# EAGLE design Mic to Pi Entire design including pinouts (EAGLE 9.6.2)
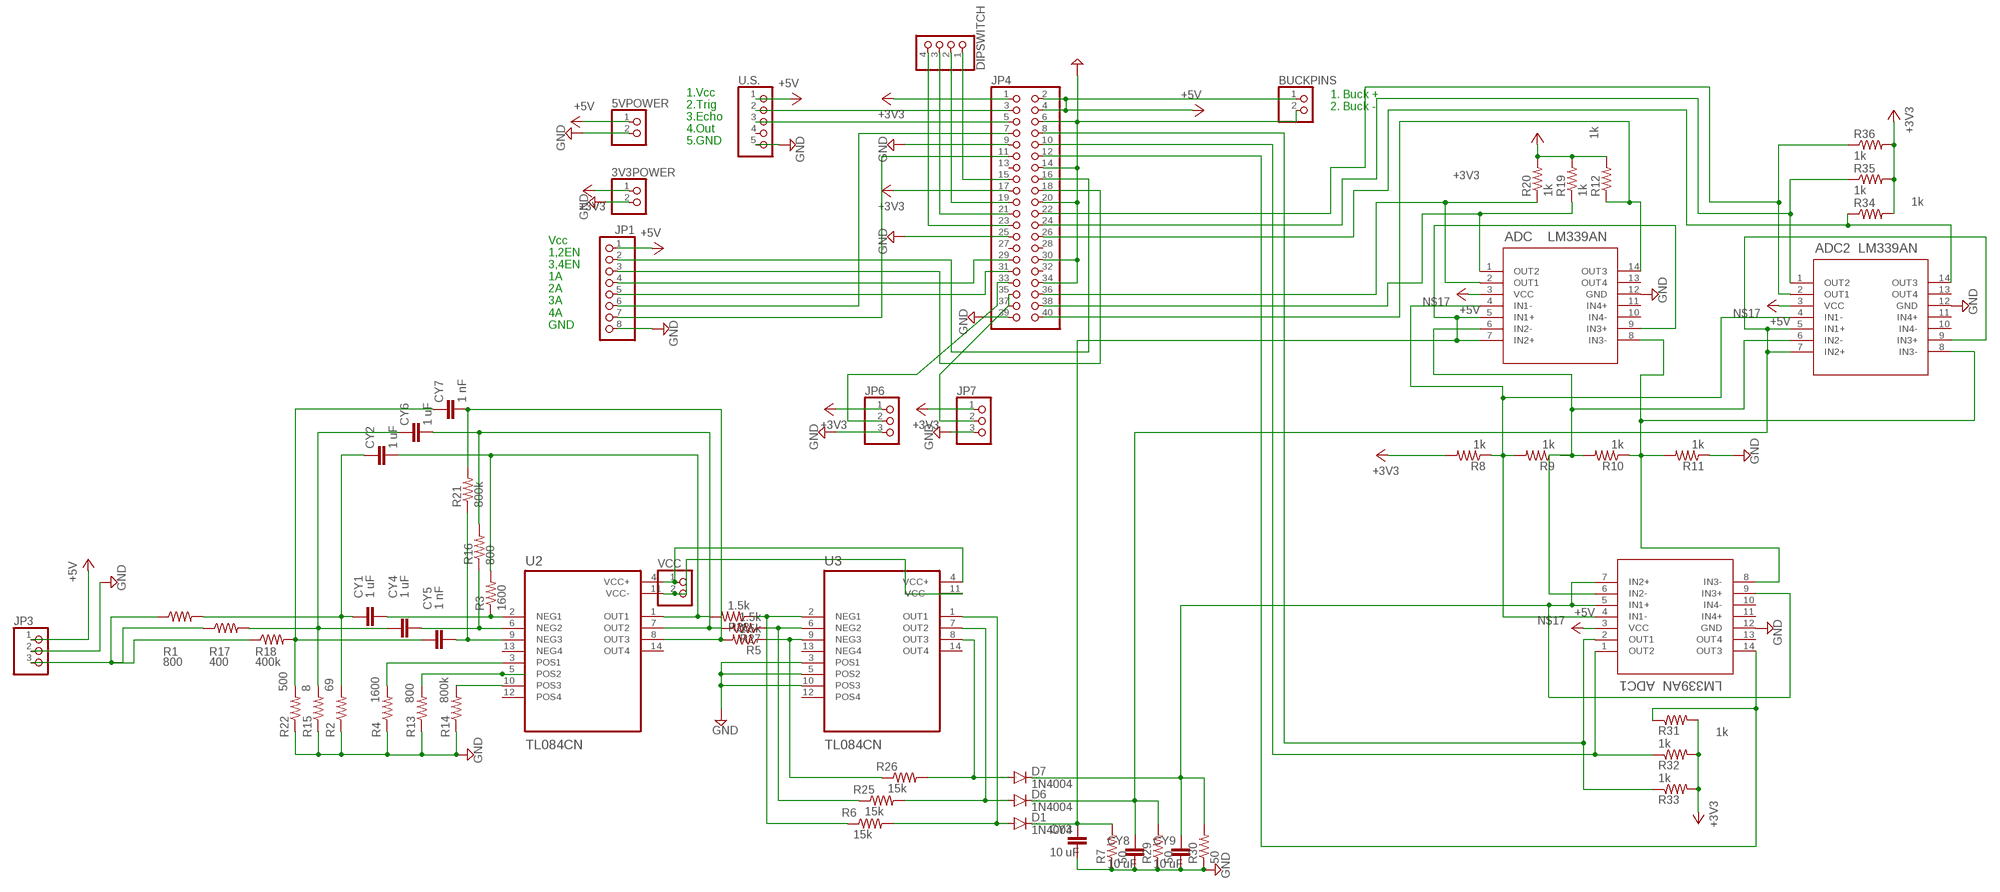
[diagram p0: schematic, sheet 1]

## Parts
3V3POWER  PINHD-1X2  [1X02]
5VPOWER  PINHD-1X2  [1X02]
ADC  LM339AN  [PDIP14_646-06_ONS]
ADC1  LM339AN  [PDIP14_646-06_ONS]
ADC2  LM339AN  [PDIP14_646-06_ONS]
BUCKPINS  PINHD-1X2  [1X02]
CY1  1 uF  CYYC7B5  [YC7B5]
CY2  1 uF  CYYC7B5  [YC7B5]
CY3  10 uF  CYYC7B5  [YC7B5]
CY4  1 uF  CYYC7B5  [YC7B5]
CY5  1 nF  CYYC7B5  [YC7B5]
CY6  1 uF  CYYC7B5  [YC7B5]
CY7  1 nF  CYYC7B5  [YC7B5]
CY8  10 uF  CYYC7B5  [YC7B5]
CY9  10 uF  CYYC7B5  [YC7B5]
D1  1N4004  [DO41-10]
D6  1N4004  [DO41-10]
D7  1N4004  [DO41-10]
DIPSWITCH  PINHD-1X4  [1X04]
JP1  PINHD-1X8  [1X08]
JP3  PINHD-1X3  [1X03]
JP4  PINHD-2X20  [2X20]
JP6  PINHD-1X3  [1X03]
JP7  PINHD-1X3  [1X03]
R1  800  R-US_0204/7  [0204/7]
R2  69  R-US_0204/7  [0204/7]
R3  1600  R-US_0204/7  [0204/7]
R4  1600  R-US_0204/7  [0204/7]
R5  1.5k  R-US_0204/7  [0204/7]
R6  15k  R-US_0204/7  [0204/7]
R7  50  R-US_0204/7  [0204/7]
R8  1k  R-US_0204/7  [0204/7]
R9  1k  R-US_0207/2V  [0207/2V]
R10  1k  R-US_0207/2V  [0207/2V]
R11  1k  R-US_0207/2V  [0207/2V]
R12  1k  R-US_0207/2V  [0207/2V]
R13  800  R-US_0204/7  [0204/7]
R14  800k  R-US_0204/7  [0204/7]
R15  8  R-US_0204/7  [0204/7]
R16  800  R-US_0204/7  [0204/7]
R17  400  R-US_0204/7  [0204/7]
R18  400k  R-US_0204/7  [0204/7]
R19  1k  R-US_0204/7  [0204/7]
R20  1k  R-US_0204/7  [0204/7]
R21  800k  R-US_0204/7  [0204/7]
R22  500  R-US_0204/7  [0204/7]
R25  15k  R-US_0204/7  [0204/7]
R26  15k  R-US_0204/7  [0204/7]
R27  1.5k  R-US_0204/7  [0204/7]
R28  1.5k  R-US_0204/7  [0204/7]
R29  50  R-US_0204/7  [0204/7]
R30  50  R-US_0204/7  [0204/7]
R31  1k  R-US_0207/2V  [0207/2V]
R32  1k  R-US_0204/7  [0204/7]
R33  1k  R-US_0204/7  [0204/7]
R34  1k  R-US_0207/2V  [0207/2V]
R35  1k  R-US_0204/7  [0204/7]
R36  1k  R-US_0204/7  [0204/7]
U2  TL084CN  [DIP794W45P254L1969H508Q14]
U3  TL084CN  [DIP794W45P254L1969H508Q14]
U.S.  PINHD-1X55X2MM  [1_05X2MM]
VCC  PINHD-1X2  [1X02]

## Nets
+3V3: 3V3POWER.1 JP4.1 JP4.17 JP6.1 JP7.1 R8.2 R12.2 R19.2 R20.2 R31.2 R32.2 R33.2 R34.2 R35.2 R36.2
+5V: 5VPOWER.1 ADC1.3(VCC) ADC2.3(VCC) ADC.3(VCC) BUCKPINS.1 JP1.1 JP3.1 JP4.2 JP4.4 U.S..1
GND: 3V3POWER.2 5VPOWER.2 ADC1.12(GND) ADC2.12(GND) ADC.12(GND) BUCKPINS.2 CY3.2 CY8.2 CY9.2 JP1.8 JP3.2 JP4.6 JP4.9 JP4.14 JP4.20 JP4.25 JP4.30 JP4.34 JP4.39 JP6.3 JP7.3 R2.1 R4.1 R7.1 R11.1 R13.1 R14.1 R15.1 R22.1 R29.1 R30.1 U3.3(POS1) U3.5(POS2) U3.10(POS3) U.S..5
N$1: R6.1 R28.1 U3.2(NEG1)
N$2: R13.2 U2.5(POS2)
N$3: R14.2 U2.10(POS3)
N$4: JP3.3 R1.1 R17.1 R18.1
N$5: CY4.1 CY6.1 R15.2 R17.2
N$6: CY5.1 CY7.1 R18.2 R22.2
N$7: CY4.2 R16.1 U2.6(NEG2)
N$8: CY2.2 R3.2 R28.2 U2.1(OUT1)
N$9: CY5.2 R21.1 U2.9(NEG3)
N$10: CY6.2 R16.2 R27.2 U2.7(OUT2)
N$11: CY1.1 CY2.1 R1.2 R2.2
N$12: CY1.2 R3.1 U2.2(NEG1)
N$13: R4.2 U2.3(POS1)
N$14: CY7.2 R5.2 R21.2 U2.8(OUT3)
N$15: ADC.5(IN1+) ADC.7(IN2+) ADC.9(IN3+) CY3.1 D1.C R7.2
N$16: ADC.1(OUT2) JP4.38 R19.1
N$17: ADC1.4(IN1-) ADC2.4(IN1-) ADC.4(IN1-) R8.1 R9.2
N$18: ADC1.6(IN2-) ADC2.6(IN2-) ADC.6(IN2-) R9.1 R10.2
N$19: ADC1.8(IN3-) ADC2.8(IN3-) ADC.8(IN3-) R10.1 R11.2
N$20: ADC.2(OUT1) JP4.36 R20.1
N$21: ADC.14(OUT3) JP4.40 R12.1
N$22: JP4.3 U.S..2
N$23: JP4.5 U.S..3
N$24: R25.1 R27.1 U3.6(NEG2)
N$25: D1.A R6.2 U3.1(OUT1)
N$26: R5.1 R26.1 U3.9(NEG3)
N$27: D7.A R26.2 U3.8(OUT3)
N$28: JP1.4 JP4.29
N$29: JP1.5 JP4.31
N$30: JP1.6 JP4.7
N$31: JP1.7 JP4.11
N$32: JP1.2 JP4.16
N$33: JP1.3 JP4.18
N$34: DIPSWITCH.1 JP4.15
N$35: DIPSWITCH.2 JP4.19
N$36: DIPSWITCH.3 JP4.21
N$37: DIPSWITCH.4 JP4.23
N$38: JP4.33 JP6.2
N$39: JP4.35 JP4.37 JP7.2
N$43: U2.11(VCC-) U3.11(VCC-) VCC.2
N$44: U2.4(VCC+) U3.4(VCC+) VCC.1
N$45: D6.A R25.2 U3.7(OUT2)
N$50: ADC2.5(IN1+) ADC2.7(IN2+) ADC2.9(IN3+) CY8.1 D6.C R29.2
N$51: ADC1.5(IN1+) ADC1.7(IN2+) ADC1.9(IN3+) CY9.1 D7.C R30.2
N$55: ADC1.1(OUT2) JP4.10 R32.1
N$56: ADC1.14(OUT3) JP4.12 R31.1
N$57: ADC1.2(OUT1) JP4.8 R33.1
N$61: ADC2.1(OUT2) JP4.24 R35.1
N$62: ADC2.14(OUT3) JP4.26 R34.1
N$63: ADC2.2(OUT1) JP4.22 R36.1
Unconnected: ADC1.10(IN4-) ADC1.11(IN4+) ADC1.13(OUT4) ADC2.10(IN4-) ADC2.11(IN4+) ADC2.13(OUT4) ADC.10(IN4-) ADC.11(IN4+) ADC.13(OUT4) JP4.13 JP4.27 JP4.28 JP4.32 U2.12(POS4) U2.13(NEG4) U2.14(OUT4) U3.12(POS4) U3.13(NEG4) U3.14(OUT4) U.S..4

## Notes on the sheet
- 1. Buck +
  2. Buck -
- 1.Vcc
  2.Trig
  3.Echo
  4.Out
  5.GND
- Vcc
  1,2EN
  3,4EN
  1A
  2A
  3A
  4A
  GND

## Library data of the parts
3V3POWER 5VPOWER BUCKPINS VCC = pinhead:PINHD-1X2: PIN HEADER
ADC ADC1 ADC2 = LM339AN:LM339AN; COPYRIGHT: Copyright (C) 2022 Ultra Librarian. All rights reserved.; DIGI-KEY_PART_NUMBER_1: 2156-LM339AN-HC-ND; DIGI-KEY_PART_NUMBER_2: 2156-LM339AN-ON-ND; DIGI-KEY_PART_NUMBER_3: 296-6605-5-ND; DIGI-KEY_PART_NUMBER_4: 497-1587-5-ND; DIGI-KEY_PART_NUMBER_5: LM339ANFS-ND; MANUFACTURER_PART_NUMBER: LM339AN; MFR_NAME: onsemi
CY1-CY9 = rcl:CY: Y CAPACITOR for power line; SPICEPREFIX: C
D1 D6 D7 = diode:1N4004: DIODE general purpose rectifier, 1 A
DIPSWITCH = pinhead:PINHD-1X4: PIN HEADER
JP1 = pinhead:PINHD-1X8: PIN HEADER
JP3 JP6 JP7 = pinhead:PINHD-1X3: PIN HEADER
JP4 = pinhead:PINHD-2X20: PIN HEADER
R1-R22 R25-R36 = rcl:R-US_: RESISTOR, American symbol; SPICEPREFIX: R
U2 U3 = TL084CN:TL084CN; DESCRIPTION: Quad High Slew Rate JFET-Input Operational Amplifier 14-PDIP 0 to 70; DIGI-KEY_PART_NUMBER: 296-1784-5-ND; MF: Texas Instruments; MP: TL084CN; PACKAGE: PDIP-14 Texas Instruments; PURCHASE-URL: https://pricing.snapeda.com/search/part/TL084CN/?ref=eda
U.S. = pinhead:PINHD-1X5: PIN HEADER

## Board
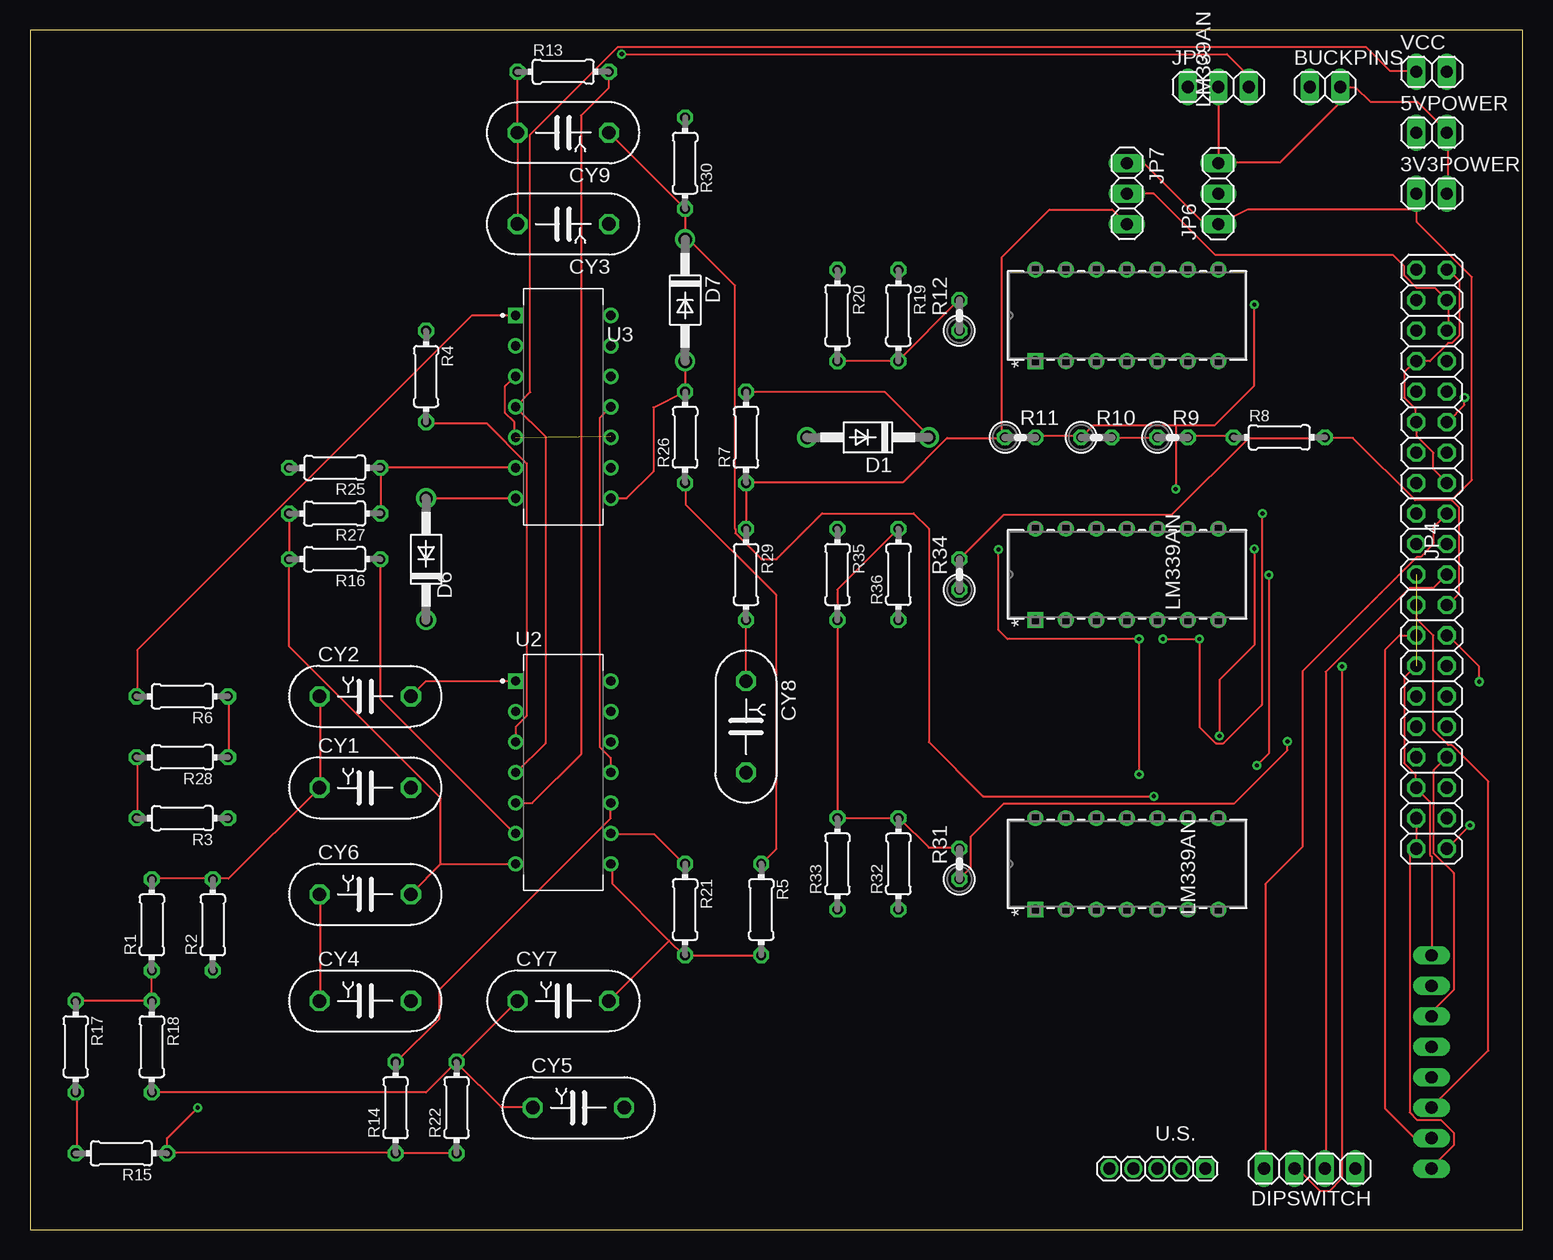
[diagram p1: board, top side]
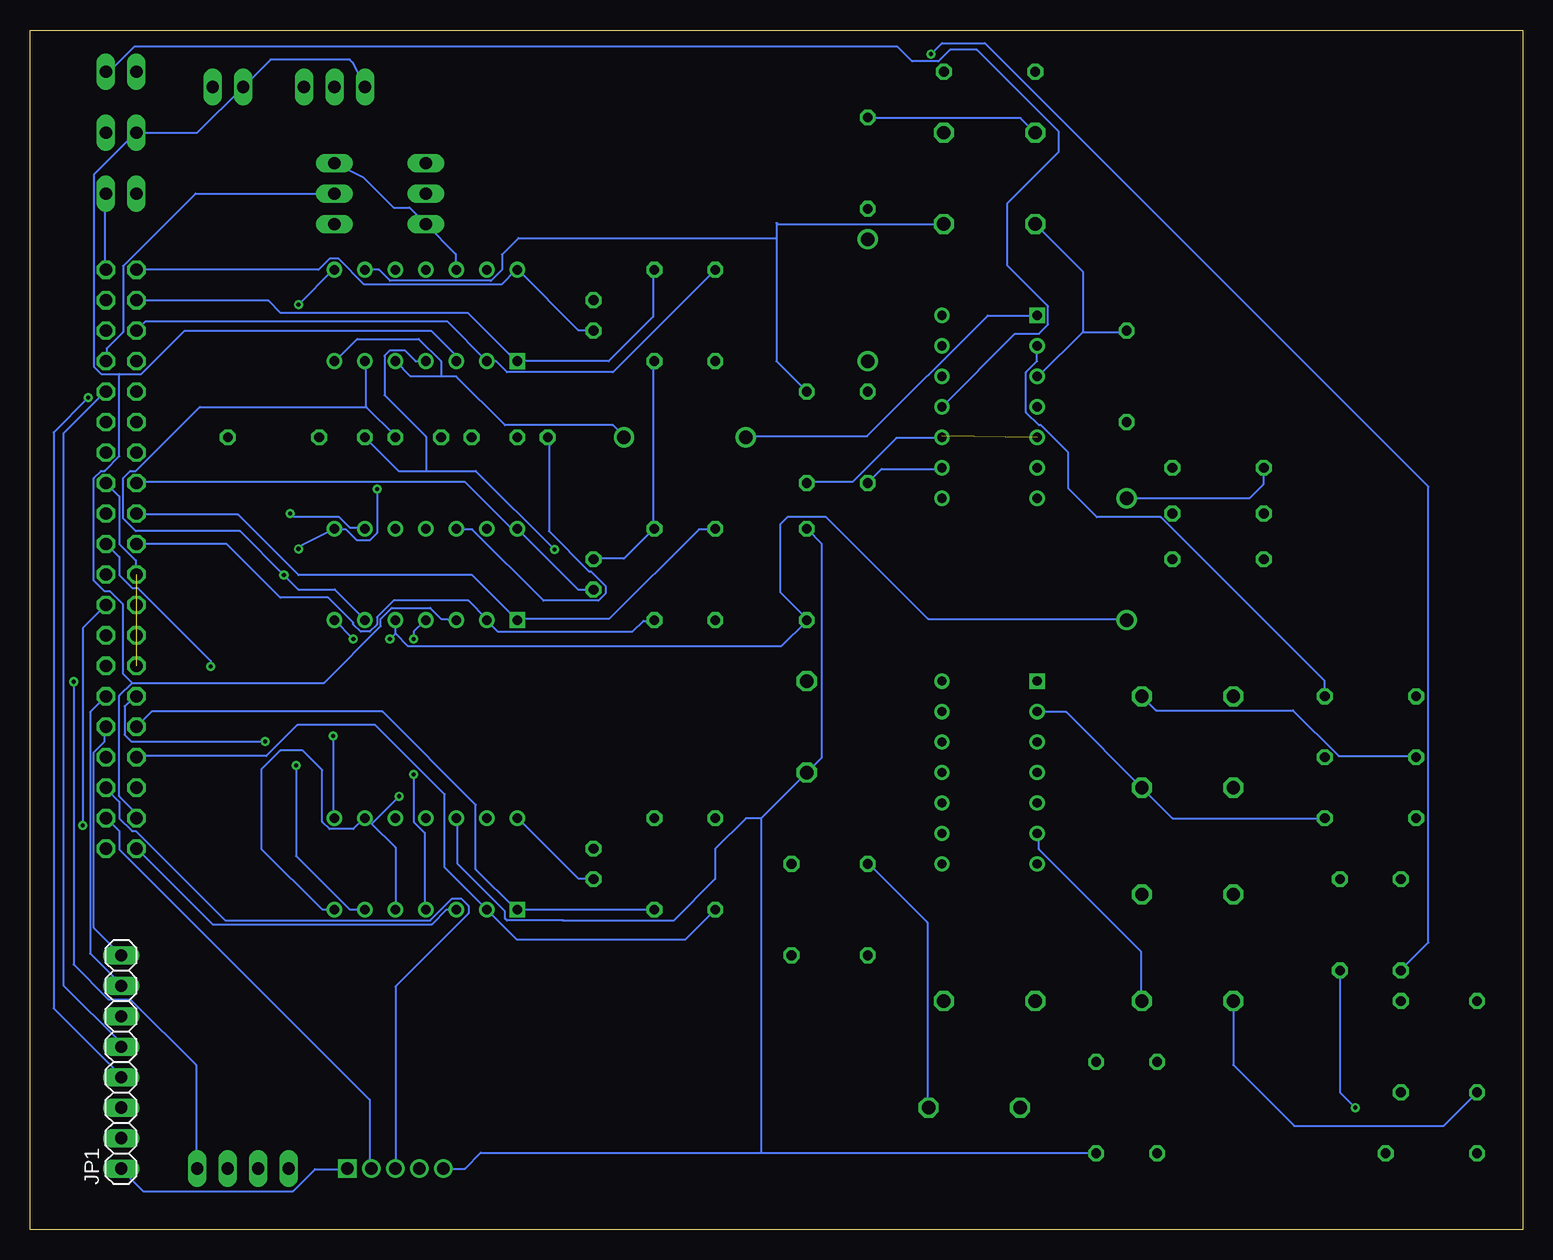
[diagram p2: board, bottom side, seen from below]

Size 124.44 x 100 mm. Coordinates in mm from the lower left corner, seen from the top.
Outline: 0,0 124.44,0 124.44,100 0,100 0,0
Copper layers (1*16): Top 0.035mm / dielectric 1.5mm / Bottom 0.035mm
Design rules "default": minimum track width 6mil, minimum drill 0.35mm, track to track 6mil, track to pad 6mil, pad to pad 6mil, via to via 6mil, smd to smd 6mil, copper to edge 40mil, drill to drill 6mil, minimum pad ring 10mil, minimum via ring 8mil, stop-mask expansion 4mil, vias tented up to drill 0mil, thermal gap 10mil

### Footprints (pad centres in the part's own frame; a part is rotated, then mirrored left to right if it is on the bottom)
1X02 = drill 1.016 long: 1 -1.27,0; 2 1.27,0
PDIP14_646-06_ONS = drill 0.813 pad 1.321 square: 1 0,0 | drill 0.813 pad 1.321: 2 0,-2.54; 3 0,-5.08; 4 0,-7.62; 5 0,-10.16; 6 0,-12.7; 7 0,-15.24; 8 7.62,-15.24; 9 7.62,-12.7; 10 7.62,-10.16; 11 7.62,-7.62; 12 7.62,-5.08; 13 7.62,-2.54; 14 7.62,0
YC7B5 = drill 1.118 octagon: 1 -3.81,0; 2 3.81,0
DO41-10 = drill 1.118: A 5.08,0; C -5.08,0
1X04 = drill 1.016 long: 1 -3.81,0; 2 -1.27,0; 3 1.27,0; 4 3.81,0
1X08 = drill 1.016 long: 1 -8.89,0; 2 -6.35,0; 3 -3.81,0; 4 -1.27,0; 5 1.27,0; 6 3.81,0; 7 6.35,0; 8 8.89,0
1X03 = drill 1.016 long: 1 -2.54,0; 2 0,0; 3 2.54,0
2X20 = drill 1.016 octagon: 1 -24.13,-1.27; 2 -24.13,1.27; 3 -21.59,-1.27; 4 -21.59,1.27; 5 -19.05,-1.27; 6 -19.05,1.27; 7 -16.51,-1.27; 8 -16.51,1.27; 9 -13.97,-1.27; 10 -13.97,1.27; 11 -11.43,-1.27; 12 -11.43,1.27; 13 -8.89,-1.27; 14 -8.89,1.27; 15 -6.35,-1.27; 16 -6.35,1.27; 17 -3.81,-1.27; 18 -3.81,1.27; 19 -1.27,-1.27; 20 -1.27,1.27; 21 1.27,-1.27; 22 1.27,1.27; 23 3.81,-1.27; 24 3.81,1.27; 25 6.35,-1.27; 26 6.35,1.27; 27 8.89,-1.27; 28 8.89,1.27; 29 11.43,-1.27; 30 11.43,1.27; 31 13.97,-1.27; 32 13.97,1.27; 33 16.51,-1.27; 34 16.51,1.27; 35 19.05,-1.27; 36 19.05,1.27; 37 21.59,-1.27; 38 21.59,1.27; 39 24.13,-1.27; 40 24.13,1.27
0204/7 = drill 0.813 octagon: 1 -3.81,0; 2 3.81,0
0207/2V = drill 0.813 octagon: 1 -1.27,0; 2 1.27,0
DIP794W45P254L1969H508Q14 = drill 0.77 pad 1.17 square: 1 -3.97,7.62 | drill 0.77 pad 1.17: 2 -3.97,5.08; 3 -3.97,2.54; 4 -3.97,0; 5 -3.97,-2.54; 6 -3.97,-5.08; 7 -3.97,-7.62; 8 3.97,-7.62; 9 3.97,-5.08; 10 3.97,-2.54; 11 3.97,0; 12 3.97,2.54; 13 3.97,5.08; 14 3.97,7.62
1_05X2MM = drill 1.016 pad 1.3 square: 1 -4,0 | drill 1.016 pad 1.3: 2 -2,0; 3 0,0; 4 2,0; 5 4,0

### Placement (x,y rotation side)
3V3POWER  116.84,86.36 0 top
5VPOWER  116.84,91.44 0 top
ADC  83.82,72.39 90 top
ADC1  83.82,26.67 90 top
ADC2  83.82,50.8 90 top
BUCKPINS  107.95,95.25 0 top
CY1  27.94,36.83 0 top
CY2  27.94,44.45 0 top
CY3  44.45,83.82 180 top
CY4  27.94,19.05 0 top
CY5  45.72,10.16 0 top
CY6  27.94,27.94 0 top
CY7  44.45,19.05 0 top
CY8  59.69,41.91 270 top
CY9  44.45,91.44 180 top
D1  69.85,66.04 180 top
D6  33.02,55.88 90 top
D7  54.61,77.47 270 top
DIPSWITCH  106.68,5.08 180 top
JP1  116.84,13.97 90 bottom
JP3  99.06,95.25 0 top
JP4  116.84,55.88 90 top
JP6  99.06,86.36 90 top
JP7  91.44,86.36 270 top
R1  10.16,25.4 90 top
R2  15.24,25.4 90 top
R3  12.7,34.29 180 top
R4  33.02,71.12 270 top
R5  60.96,26.67 270 top
R6  12.7,44.45 180 top
R7  59.69,66.04 90 top
R8  104.14,66.04 0 top
R9  95.25,66.04 0 top
R10  88.9,66.04 0 top
R11  82.55,66.04 0 top
R12  77.47,76.2 90 top
R13  44.45,96.52 0 top
R14  30.48,10.16 90 top
R15  7.62,6.35 180 top
R16  25.4,55.88 180 top
R17  3.81,15.24 270 top
R18  10.16,15.24 270 top
R19  72.39,76.2 270 top
R20  67.31,76.2 270 top
R21  54.61,26.67 270 top
R22  35.56,10.16 90 top
R25  25.4,63.5 180 top
R26  54.61,66.04 90 top
R27  25.4,59.69 180 top
R28  12.7,39.37 180 top
R29  59.69,54.61 270 top
R30  54.61,88.9 270 top
R31  77.47,30.48 90 top
R32  72.39,30.48 90 top
R33  67.31,30.48 90 top
R34  77.47,54.61 90 top
R35  67.31,54.61 270 top
R36  72.39,54.61 90 top
U2  44.45,38.1 0 top
U3  44.45,68.58 0 top
U.S.  93.98,5.08 180 top
VCC  116.84,96.52 0 top

### Tracks (layer width: path | path; a pad name or v marks a point on that pad's centre or on a via)
+3V3  (via drill 0.35)
  Top 0.152: 118.52,60.81 115.47,60.81 110.29,65.99 108,65.99 R8.2 107.85,65.99 101.6,65.99 95.2,59.59 81.18,59.59 R34.2 | 118.52,60.81 119.13,60.2 119.13,53.03 118.21,52.12 JP4.17 | v120.04,33.68 JP4.1 | 115.62,85.04 115.62,83.97 120.19,79.4 120.19,62.48 118.52,60.81 | 115.62,85.04 115.62,86.26 3V3POWER.1 115.62,85.04 | R31.2 77.37,31.85 74.93,31.85 72.49,34.29 R32.2 R33.2 R35.2 67.31,53.34 R36.2 | 72.34,72.39 R20.2 | 72.34,72.39 77.37,77.42 R12.2 | 72.34,72.39 R19.2 | JP7.1 92.39,89.37 97.94,83.82 JP6.1 101.5,85.04 115.62,85.04
  Bottom 0.152: v120.04,33.68 120.04,50.14 JP4.17 | R34.2 77.37,55.93 74.93,55.93 72.49,58.37 R36.2 72.49,58.52 72.49,72.39 R19.2
+5V
  Top 0.152: JP1.1 116.84,5.18 118.67,7.01 118.67,8.08 117.6,9.14 115.62,9.14 115.01,9.75 115.01,31.24 115.47,31.7 JP4.2 115.62,31.85 115.62,34.29 JP4.4
  Bottom 0.152: ADC.3 88.9,72.85 90.98,74.93 111.56,74.93 115.16,71.32 116.99,71.32 | 116.99,71.32 118.52,71.32 119.13,71.93 119.13,87.94 115.62,91.44 5VPOWER.1 110.49,91.44 BUCKPINS.1 104.39,97.54 97.79,97.54 97.54,97.28 JP3.1 | 115.93,45.57 99.92,45.57 95.2,50.29 95.2,50.9 94.28,51.82 91.08,51.82 90.17,50.9 88.95,50.9 ADC2.3 | 115.93,45.57 116.99,44.5 116.99,36.12 115.62,34.75 115.62,34.29 JP4.4 | U.S..1 98.09,5.03 100.69,5.03 102.51,3.2 115.01,3.2 116.84,5.03 JP1.1 | ADC1.3 89.71,26.67 90.93,25.45 109.22,25.45 115.47,31.7 JP4.2 | 116.99,71.32 116.99,64.47 118.21,63.25 118.52,63.25 119.13,62.64 119.13,54.1 118.21,53.19 117.75,53.19 116.69,52.12 116.69,46.33 115.93,45.57
GND  (via drill 0.35)  (2 unrouted)
  Top 0.152: JP1.8 116.84,31.09 116.69,31.24 116.69,35.66 115.62,36.73 JP4.6 115.47,36.88 115.47,37.95 114.55,38.86 114.55,46.02 115.47,46.94 115.52,46.94 JP4.14 | JP4.25 118.06,62.33 116.99,63.4 116.99,64.77 115.62,66.14 115.62,67.21 JP4.30 115.47,67.36 115.47,68.43 114.55,69.34 114.55,71.48 115.47,72.39 JP4.34 116.69,72.39 118.21,73.91 118.52,73.91 119.13,74.52 119.13,79.1 118.21,80.01 JP4.39 | 118.21,91.44 118.21,86.41 3V3POWER.2 | 118.21,91.44 5VPOWER.2 118.06,91.44 | R29.1 R7.1 59.69,62.33 72.8,62.33 76.45,65.99 81.03,65.99 | 81.03,65.99 81.18,65.99 R11.1 81.03,65.99 | U3.5 40.33,66.14 40.33,67.36 39.57,68.12 39.57,70.26 40.33,71.02 U3.3 | R13.1 CY9.2 CY3.2 | R22.1 35.46,6.4 30.58,6.4 R14.1 30.43,6.4 11.53,6.4 R15.1 11.43,7.62 v13.97,10.16 | 109.27,95.2 BUCKPINS.2 | 81.03,65.99 81.03,81.08 84.99,85.04 90.22,85.04 JP7.3 | BUCKPINS.2 109.22,93.98 104.19,88.95 99.16,88.95 JP6.3 JP3.2 | 118.21,91.44 115.67,93.98 111.76,93.98 110.49,95.25 BUCKPINS.2
  Bottom 0.152: JP1.8 119.13,25.15 119.13,39.78 118.21,40.69 118.21,41.91 JP4.9 | JP4.25 116.99,61.11 116.99,57.15 115.62,55.78 115.62,54.71 JP4.20 115.47,54.56 | JP4.39 118.21,80.01 118.21,86.26 3V3POWER.2 | ADC2.12 88.8,58.37 87.58,58.37 81.64,52.43 77.06,52.43 76.45,53.03 76.45,53.65 77.67,54.86 77.83,54.86 81.18,58.22 81.18,65.99 R11.1 | 48.41,66.14 U3.10 48.56,65.99 52.22,65.99 55.88,62.33 59.69,62.33 R7.1 | 40.49,66.14 U3.5 | 36.68,74.83 33.02,74.83 R4.1 | 36.68,74.83 40.33,71.17 U3.3 | CY9.2 41.86,92.66 54.51,92.66 R30.1 | 36.68,74.83 36.68,79.86 CY3.2 | 15.19,21.49 R2.1 15.24,11.43 v13.97,10.16 | ADC1.12 88.8,34.29 88.8,30.48 84.84,26.52 84.84,25.91 84.68,25.76 80.01,25.76 79.98,25.78 70.75,25.78 67.32,29.21 67.32,31.74 64.77,34.29 63.5,34.29 | 63.5,6.4 86.87,6.4 88.19,5.08 U.S..5 | 63.5,6.4 35.61,6.4 R22.1 | R29.1 58.42,57.15 58.42,39.37 CY8.2 63.5,34.29 | 63.5,34.29 63.5,6.4 | ADC.12 88.95,80.01 88.95,81.33 JP7.3 92.81,85.19 94.13,85.19 96.62,87.68 JP6.3
N$1
  Top 0.152: R28.1 16.56,39.47 16.56,44.35 R6.1
  Bottom 0.152: R6.1 16.51,45.72 30.17,59.38 35.51,59.38 37.9,61.77 37.9,64.77 40.18,67.06 40.33,67.06 41.4,68.12 41.4,71.48 40.49,72.39 40.49,73.61 U3.2
N$2
  Top 0.152: U2.5 41.86,35.56 45.92,39.62 45.92,92.86 48.26,95.2 R13.2
N$3
  Top 0.152: U2.10 48.41,35.51 48.41,34.29 34.14,20.02 34.14,17.58 30.58,14.02 R14.2
N$4  (via drill 0.35)
  Top 0.152: R17.1 R18.1 R1.1 | v49.33,97.99 99.77,97.99 101.14,96.62 101.6,96.62 JP3.3
  Bottom 0.152: R1.1 10.16,21.64 7.87,23.93 7.87,61.92 44.86,98.91 48.41,98.91 v49.33,97.99
N$5
  Top 0.152: R15.2 3.91,6.4 3.91,11.43 R17.2 | CY4.1 24.18,19.05 24.18,27.89 CY6.1
  Bottom 0.152: CY4.1 24.13,13.72 19.05,8.64 6.6,8.64 R17.2
N$6
  Top 0.152: R18.2 33.02,11.43 R22.2 | CY5.1 41.86,10.21 39.27,10.21 35.61,13.87 R22.2 | R22.2 CY7.1
N$7
  Top 0.152: R16.1 29.21,44.2 40.33,33.07 U2.6
  Bottom 0.152: U2.6 40.33,32.92 40.33,31.7 31.8,23.16 31.8,19.05 CY4.2
N$8
  Top 0.152: R3.2 8.94,34.29 8.94,39.32 R28.2 | U2.1 33.02,45.72 CY2.2
  Bottom 0.152: CY2.2 30.58,43.28 19.15,43.28 15.34,39.47 8.94,39.47 R28.2
N$9
  Top 0.152: U2.9 48.56,32.92 52.07,32.92 54.51,30.48 R21.1
  Bottom 0.152: CY5.2 49.63,10.21 49.63,25.6 54.51,30.48 R21.1
N$10
  Top 0.152: R27.2 R16.2 21.59,48.62 34.24,35.97 34.24,30.48 | 34.24,30.48 U2.7 | 34.24,30.48 31.8,28.04 CY6.2
N$11
  Top 0.152: R1.2 10.16,29.26 15.19,29.26 R2.2 15.34,29.26 16.56,29.26 CY1.1 24.18,36.88 24.18,44.35 CY2.1
N$12
  Bottom 0.152: U2.2 40.33,43.13 38.05,43.13 CY1.2 29.21,34.29 R3.1
N$13
  Top 0.152: U2.3 40.49,40.69 40.49,41.91 41.4,42.82 41.4,63.86 38.05,67.21 33.02,67.21 R4.2
N$14
  Top 0.152: 53.29,24.08 54.51,22.86 R21.2 R5.2 | 53.29,24.08 48.56,28.8 48.56,30.48 U2.8 | 53.29,24.08 CY7.2
N$15
  Top 0.152: R7.2 59.69,69.8 71.27,69.8 74.93,66.14 D1.C
  Bottom 0.152: ADC.7 99.01,72.39 97.16,74.24 92.02,74.24 90.17,72.39 90.17,71.12 | ADC.9 95.35,80.01 94.44,79.1 86,79.1 85.09,80.01 85.09,81.28 83.72,82.65 62.23,82.65 | R7.2 62.23,72.39 62.23,82.65 | 62.23,82.65 62.23,83.92 62.13,83.82 CY3.1 | D1.C 74.93,66.14 75.84,67.06 84.84,67.06 88.9,71.12 90.17,71.12 | 90.17,71.12 92.71,71.12 ADC.5
N$16
  Bottom 0.152: R19.1 72.49,80.01 72.49,76.1 76.2,72.39 ADC.1 83.92,72.39 87.94,76.4 103.53,76.4 104.55,77.42 115.47,77.42 JP4.38
N$17  (via drill 0.35)
  Top 0.152: R9.2 96.57,66.14 100.23,66.14 R8.1 | v92.46,37.95 v92.46,49.23 81.48,49.23 80.72,49.99 v80.72,56.69
  Bottom 0.152: ADC.4 92.3,72.39 93.22,73.3 94.44,73.3 94.89,72.85 94.89,69.55 91.44,66.09 91.44,63.25 | v92.46,37.95 92.46,33.98 91.54,33.07 91.54,26.67 ADC1.4 | v92.46,49.23 92.46,49.84 91.54,50.75 ADC2.4 | v80.72,56.69 87.27,63.25 91.44,63.25 | R9.2 93.73,63.25 91.44,63.25
N$18  (via drill 0.35)
  Top 0.152: v103.28,54.56 103.28,39.7 v102.26,38.68 | R10.2 R9.1
  Bottom 0.152: 96.42,68.58 96.42,72.39 ADC.6 | 96.42,68.58 93.98,66.14 R9.1 | ADC1.6 97.79,26.67 102.26,31.14 v102.26,38.68 | ADC2.6 96.57,50.9 99.03,53.37 102.08,53.37 v103.28,54.56 106.93,58.22 115.62,58.22 116.69,59.28 116.69,62.64 116.08,63.25 115.62,63.25 110.29,68.58 96.42,68.58
N$19  (via drill 0.35)
  Top 0.152: v99.16,41.15 99.16,45.82 102.06,48.72 v102.06,56.74 | R11.2 83.92,66.14 87.58,66.14 R10.1 88.65,67.06 95.5,67.06 | v102.06,77.11 102.06,70.36 98.75,67.06 95.5,67.06 | 95.5,67.06 v95.5,61.72
  Bottom 0.152: v99.16,41.15 99.16,34.29 ADC1.8 | v102.06,56.74 101.7,57.1 ADC2.8 99.01,58.37 98.09,58.37 97.18,57.45 96.11,57.45 95.5,58.06 v95.5,61.72 | v102.06,77.11 99.16,80.01 ADC.8
N$20
  Bottom 0.152: R20.1 75.84,71.48 84.68,71.48 85.6,72.39 ADC.2 89.69,75.72 114.78,75.72 JP4.36
N$21
  Bottom 0.152: R12.1 77.52,74.98 78.74,74.98 83.77,80.01 ADC.14 83.92,80.01 85.14,78.79 96.57,78.79 98.7,80.92 99.47,80.92 100.38,80.01 JP4.40
N$22
  Bottom 0.152: U.S..2 96.11,5.18 96.11,10.82 116.99,31.7 116.99,33.22 118.06,34.29 JP4.3
N$23
  Bottom 0.152: U.S..3 93.98,20.27 87.88,26.36 87.88,26.98 88.49,27.58 89.26,27.58 91.08,25.76 108.15,25.76 115.62,33.22 115.93,33.22 116.99,34.29 116.99,35.66 118.06,36.73 JP4.5
N$24
  Top 0.152: U3.6 40.33,63.55 29.21,63.55 R25.1 R27.1
N$25
  Top 0.152: U3.1 36.83,76.2 8.94,48.31 8.94,44.5 R6.2
  Bottom 0.152: U3.1 44.6,76.2 54.66,66.14 64.72,66.14 D1.A
N$26
  Top 0.152: R5.1 62.18,31.7 62.18,52.93 54.66,60.45 54.66,62.18 R26.1
  Bottom 0.152: R26.1 53.44,63.4 48.56,63.4 U3.9
N$27
  Top 0.152: U3.8 49.73,60.96 51.97,63.2 51.97,68.53 R26.2 54.66,69.95 54.66,72.39 D7.A
N$28  (via drill 0.35)
  Top 0.152: v119.58,69.34 119.58,68.73 118.21,67.36 JP4.29
  Bottom 0.152: v119.58,69.34 122.48,66.45 122.48,18.44 116.84,12.8 JP1.4
N$29
  Bottom 0.152: JP1.5 116.84,15.54 121.67,20.37 121.67,66.34 118.21,69.8 JP4.31
N$30
  Top 0.152: JP1.6 116.84,18.14 118.67,19.96 118.67,29.72 116.99,31.39 116.99,38.25 JP4.7
N$31
  Bottom 0.152: JP4.11 119.43,43.13 119.43,23.01 116.84,20.42 JP1.7
N$32
  Top 0.152: JP1.2 115.42,7.62 112.98,10.06 112.98,48.36 114.2,49.58 114.2,49.53 JP4.16
N$33
  Top 0.152: JP4.18 115.62,51.97 115.62,50.9 116.99,49.53 116.99,41.6 118.21,40.39 118.52,40.39 121.56,37.34 121.56,14.94 116.84,10.21 JP1.3
N$34  (via drill 0.35)
  Top 0.152: v120.8,45.67 120.8,46.94 118.21,49.53 JP4.15
  Bottom 0.152: v120.8,45.67 120.8,22.1 117.91,19.2 116.08,19.2 110.59,13.72 110.59,5.18 DIPSWITCH.1
N$35
  Top 0.152: JP4.19 116.99,53.49 115.01,53.49 108,46.48 108,5.18 DIPSWITCH.2
N$36  (via drill 0.35)
  Top 0.152: v109.37,46.94 109.37,4.27 108.31,3.2 107.54,3.2 105.72,5.03 105.41,5.03 DIPSWITCH.3
  Bottom 0.152: v109.37,46.94 109.37,47.4 115.47,53.49 115.93,53.49 116.99,54.56 116.99,56.08 118.06,57.15 JP4.21
N$37
  Top 0.152: DIPSWITCH.4 102.97,5.18 102.97,28.8 106.07,31.9 106.07,46.53 115.62,56.08 115.93,56.08 116.99,57.15 116.99,58.52 118.06,59.59 JP4.23
N$38
  Bottom 0.152: JP4.33 118.06,72.39 118.06,73.46 116.69,74.83 116.69,80.31 110.64,86.36 JP6.2
N$39
  Top 0.152: JP4.35 118.21,74.98 118.21,77.42 JP4.37 118.06,77.57 117.15,78.49 115.62,78.49 114.55,79.55 114.55,80.31 113.64,81.23 98.81,81.23 93.68,86.36 JP7.2
N$43
  Top 0.152: U2.11 48.41,39.32 47.5,40.23 47.5,67.67 U3.11
  Bottom 0.152: 117.75,96.62 118.06,96.62 VCC.2 117.75,96.62 | U3.11 42.32,74.68 40.33,74.68 39.57,75.44 39.57,76.96 42.98,80.37 42.98,85.55 38.68,89.84 38.68,91.52 45.52,98.35 47.75,98.35 48.72,97.38 50.9,97.38 52.12,98.6 115.77,98.6 117.75,96.62
N$44
  Top 0.152: U2.4 40.54,38.1 42.98,40.54 42.98,66.09 U3.4 | U3.4 41.71,69.8 41.71,91.29 49.02,98.6 111.35,98.6 113.34,96.62 115.47,96.62 VCC.1 | U3.4
N$45
  Top 0.152: D6.A U3.7
  Bottom 0.152: 21.64,62.13 21.59,62.13 | 21.59,62.13 R25.2 | 21.59,62.13 22.76,60.96 D6.A
N$50  (via drill 0.35)
  Top 0.152: CY8.1 R29.2 | v94.44,49.23 v97.48,49.23 97.48,41.91 98.86,40.54 99.47,40.54 102.67,43.74 102.67,59.61 v102.74,59.69
  Bottom 0.152: 93.98,49.68 ADC2.5 | 93.98,49.68 92.91,48.62 61.82,48.62 59.69,50.75 R29.2 59.69,50.9 61.87,53.09 61.87,58.83 61.27,59.44 58.11,59.44 49.58,50.9 33.02,50.9 D6.C | v97.48,49.23 ADC2.7 | 93.98,49.68 v94.44,49.23 | v102.74,59.69 102.49,59.44 98.7,59.44 97.79,58.52 96.57,58.52 ADC2.9
N$51  (via drill 0.35)
  Top 0.152: CY9.1 R30.2 54.66,85.04 54.66,82.6 D7.C 54.91,82.55 58.78,78.69 58.78,58.42 58.8,58.4 58.8,58.05 60.97,55.88 62.23,55.88 66.04,59.69 73.66,59.69 74.93,58.42 74.93,40.64 79.45,36.12 v93.68,36.12
  Bottom 0.152: ADC1.5 93.98,31.85 95.96,33.83 | 95.96,33.83 96.42,34.29 ADC1.9 96.57,34.29 97.48,33.38 99.47,33.38 100.08,33.98 100.08,38.3 101.7,39.93 103.58,39.93 105.16,38.35 105.16,31.75 100.08,26.67 ADC1.7 | 95.96,33.83 v93.68,36.12
N$55
  Bottom 0.152: R32.1 ADC1.1 83.92,26.67 87.27,30.02 87.27,35.41 95.05,43.18 114.3,43.18 JP4.10
N$56  (via drill 0.35)
  Top 0.152: v104.83,40.69 104.83,39.95 100.38,35.51 81.18,35.51 78.44,32.77 78.44,30.18 R31.1
  Bottom 0.152: R31.1 77.52,29.26 78.74,29.26 83.77,34.29 ADC1.14 | JP4.12 115.72,44.45 116.56,43.61 116.56,41.25 116.01,40.69 v104.83,40.69
N$57
  Bottom 0.152: R33.1 69.8,24.18 83.87,24.18 ADC1.2 89.86,30.18 89.86,36.27 95.66,42.06 102.16,42.06 104.75,39.47 115.47,39.47 JP4.8
N$61
  Bottom 0.152: R35.1 67.31,58.37 68.68,58.37 76.15,50.9 83.77,50.9 ADC2.1 87.58,54.56 102.06,54.56 107.09,59.59 115.47,59.59 JP4.24
N$62
  Bottom 0.152: R34.1 78.74,53.34 ADC2.14 83.92,58.52 84.38,58.52 88.19,62.33 115.47,62.33 JP4.26
N$63
  Bottom 0.152: R36.1 72.49,50.75 73.3,50.75 74.22,49.84 85.45,49.84 86.36,50.75 ADC2.2 86.36,50.9 87.88,52.43 94.13,52.43 95.5,51.05 95.5,50.44 96.11,49.84 96.88,49.84 97.48,50.44 97.48,50.6 99.57,52.68 103.58,52.68 108.05,57.15 JP4.22